# Altium schematic sheet Amplifier_2.SchDoc
size A4
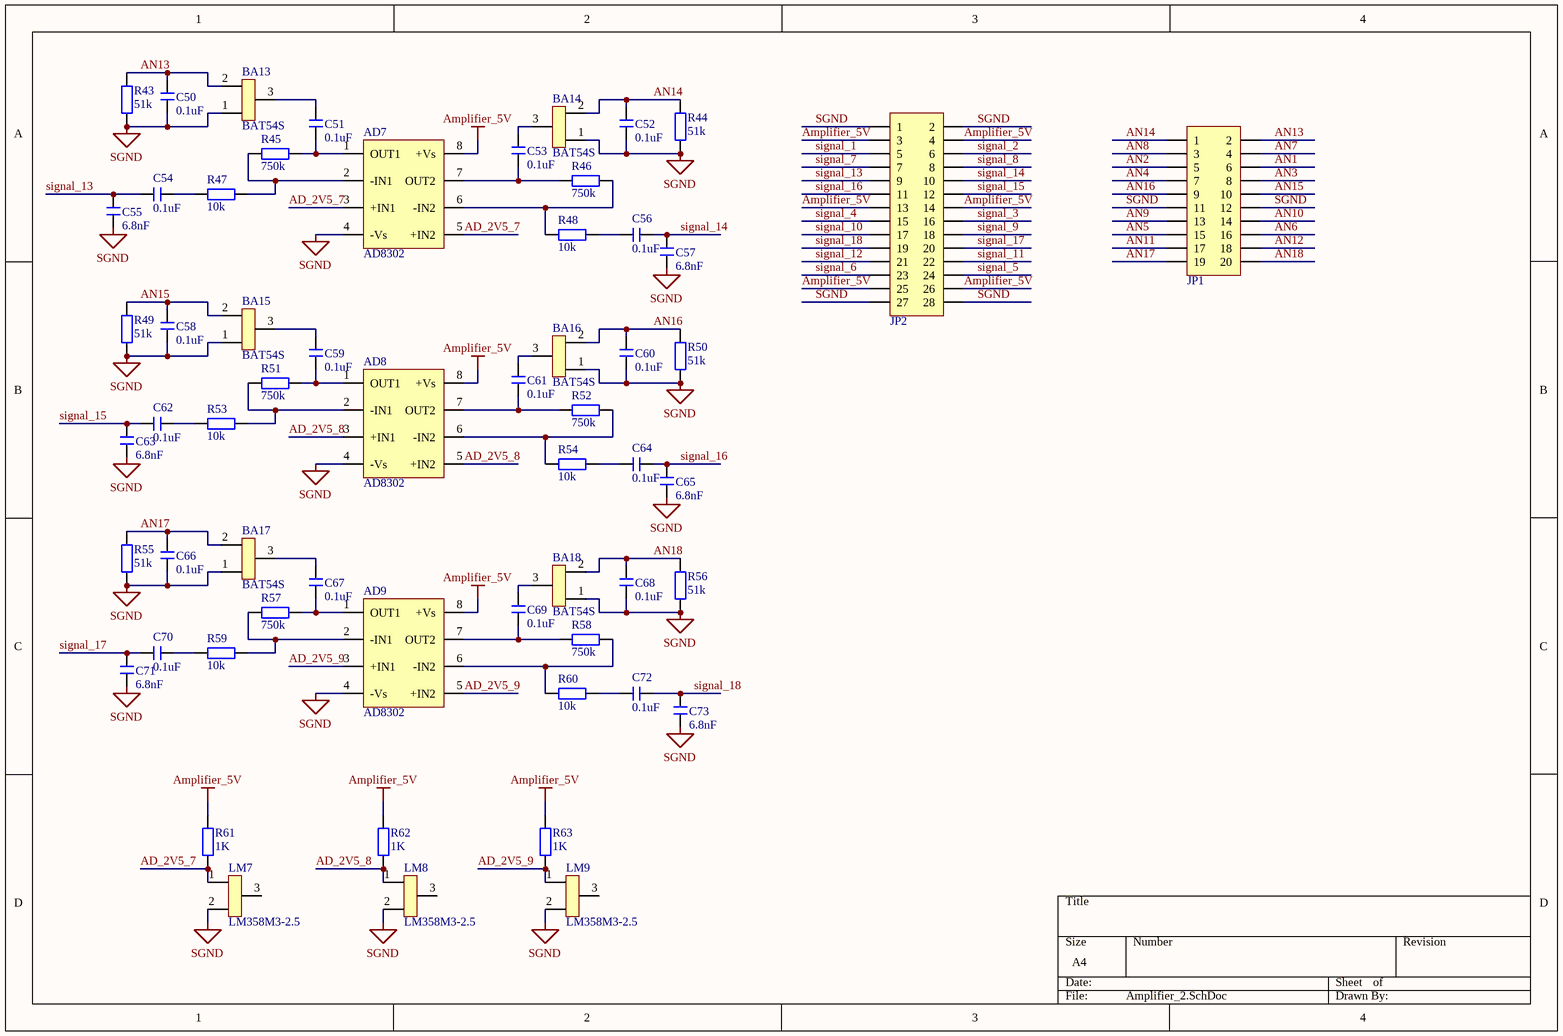
[diagram p0: Amplifier_2.SchDoc]

## Parts
AD7  AD8302  [SOIC-8]
AD8  AD8302  [SOIC-8]
AD9  AD8302  [SOIC-8]
BA13  BAT54S  [SOT23]
BA14  BAT54S  [SOT23]
BA15  BAT54S  [SOT23]
BA16  BAT54S  [SOT23]
BA17  BAT54S  [SOT23]
BA18  BAT54S  [SOT23]
C50  0.1uF  [C 0603_L]
C51  0.1uF  [C 0603_L]
C52  0.1uF  [C 0603_L]
C53  0.1uF  [C 0603_L]
C54  0.1uF  [C 0603_L]
C55  6.8nF  [C 0805_L]
C56  0.1uF  [C 0603_L]
C57  6.8nF  [C 0805_L]
C58  0.1uF  [C 0603_L]
C59  0.1uF  [C 0603_L]
C60  0.1uF  [C 0603_L]
C61  0.1uF  [C 0603_L]
C62  0.1uF  [C 0603_L]
C63  6.8nF  [C 0805_L]
C64  0.1uF  [C 0603_L]
C65  6.8nF  [C 0805_L]
C66  0.1uF  [C 0603_L]
C67  0.1uF  [C 0603_L]
C68  0.1uF  [C 0603_L]
C69  0.1uF  [C 0603_L]
C70  0.1uF  [C 0603_L]
C71  6.8nF  [C 0805_L]
C72  0.1uF  [C 0603_L]
C73  6.8nF  [C 0805_L]
JP1  Header 2X10  [HDR2.54-LI-2x10P]  (value not drawn)
JP2  Header 2X11  [HDR2.54-LI-2x14P]  (value not drawn)
LM7  LM358M3-2.5  [SOT23]
LM8  LM358M3-2.5  [SOT23]
LM9  LM358M3-2.5  [SOT23]
R43  51k  [R 0603_L]
R44  51k  [R 0603_L]
R45  750k  [R 0603_L]
R46  750k  [R 0603_L]
R47  10k  [R 0603_L]
R48  10k  [R 0603_L]
R49  51k  [R 0603_L]
R50  51k  [R 0603_L]
R51  750k  [R 0603_L]
R52  750k  [R 0603_L]
R53  10k  [R 0603_L]
R54  10k  [R 0603_L]
R55  51k  [R 0603_L]
R56  51k  [R 0603_L]
R57  750k  [R 0603_L]
R58  750k  [R 0603_L]
R59  10k  [R 0603_L]
R60  10k  [R 0603_L]
R61  1K  [R 0603_L]
R62  1K  [R 0603_L]
R63  1K  [R 0603_L]

## Nets
Amplifier_5V: AD7.8(+Vs) AD8.8(+Vs) AD9.8(+Vs) JP2.3 JP2.4 JP2.13 JP2.14 JP2.25 JP2.26 R61.1 R62.1 R63.1
SGND: AD7.4(-Vs) AD8.4(-Vs) AD9.4(-Vs) BA13.1 BA14.1 BA15.1 BA16.1 BA17.1 BA18.1 C50.1 C52.1 C55.1 C57.1 C58.1 C60.1 C63.1 C65.1 C66.1 C68.1 C71.1 C73.1 JP1.11 JP1.12 JP2.1 JP2.2 JP2.27 JP2.28 LM7.2 LM8.2 LM9.2 R43.1 R44.1 R49.1 R50.1 R55.1 R56.1
AD_2V5_7: AD7.3(+IN1) AD7.5(+IN2) LM7.1 R61.2
AD_2V5_8: AD8.3(+IN1) AD8.5(+IN2) LM8.1 R62.2
AD_2V5_9: AD9.3(+IN1) AD9.5(+IN2) LM9.1 R63.2
AN1: JP1.6
AN2: JP1.5
AN3: JP1.8
AN4: JP1.7
AN5: JP1.15
AN6: JP1.16
AN7: JP1.4
AN8: JP1.3
AN9: JP1.13
AN10: JP1.14
AN11: JP1.17
AN12: JP1.18
AN13: BA13.2 C50.2 JP1.2 R43.2
AN14: BA14.2 C52.2 JP1.1 R44.2
AN15: BA15.2 C58.2 JP1.10 R49.2
AN16: BA16.2 C60.2 JP1.9 R50.2
AN17: BA17.2 C66.2 JP1.19 R55.2
AN18: BA18.2 C68.2 JP1.20 R56.2
signal_1: JP2.5
signal_2: JP2.6
signal_3: JP2.16
signal_4: JP2.15
signal_5: JP2.24
signal_6: JP2.23
signal_7: JP2.7
signal_8: JP2.8
signal_9: JP2.18
signal_10: JP2.17
signal_11: JP2.22
signal_12: JP2.21
signal_13: C54.1 C55.2 JP2.9
signal_14: C56.2 C57.2 JP2.10
signal_15: C62.1 C63.2 JP2.12
signal_16: C64.2 C65.2 JP2.11
signal_17: C70.1 C71.2 JP2.20
signal_18: C72.2 C73.2 JP2.19
NetAD7_1: AD7.1(OUT1) C51.1 R45.2
NetAD7_2: AD7.2(-IN1) R45.1 R47.2
NetAD7_6: AD7.6(-IN2) R46.2 R48.1
NetAD7_7: AD7.7(OUT2) C53.1 R46.1
NetAD8_1: AD8.1(OUT1) C59.1 R51.2
NetAD8_2: AD8.2(-IN1) R51.1 R53.2
NetAD8_6: AD8.6(-IN2) R52.2 R54.1
NetAD8_7: AD8.7(OUT2) C61.1 R52.1
NetAD9_1: AD9.1(OUT1) C67.1 R57.2
NetAD9_2: AD9.2(-IN1) R57.1 R59.2
NetAD9_6: AD9.6(-IN2) R58.2 R60.1
NetAD9_7: AD9.7(OUT2) C69.1 R58.1
NetBA13_3: BA13.3 C51.2
NetBA14_3: BA14.3 C53.2
NetBA15_3: BA15.3 C59.2
NetBA16_3: BA16.3 C61.2
NetBA17_3: BA17.3 C67.2
NetBA18_3: BA18.3 C69.2
NetC54_2: C54.2 R47.1
NetC56_1: C56.1 R48.2
NetC62_2: C62.2 R53.1
NetC64_1: C64.1 R54.2
NetC70_2: C70.2 R59.1
NetC72_1: C72.1 R60.2

Not connected (* = marked no-connect by the designer): LM7 3; LM8 3; LM9 3

## Library data of the parts
C50-C73 = C: 贴片电容; BOM名称: 无极性贴片电容; 封装库来自淘宝卖家 ID：黄晶宝石: 其他店铺购入均为盗版假冒封装库; 联系卖家，免费查找封装: 唯一出售店铺网址https://shop463601444.taobao.com
JP1 = Header 10X2: 10*2P接插件; 封装库来自淘宝卖家  ID：黄晶宝石: 其他店铺购入均为盗版假冒封装库，请立即申请退款; 技术支持， 联系售后: 唯一出售店铺网址https://shop463601444.taobao.com; BOM名称: 10*2P接插件
JP2 = Header 14X2: 14*2P接插件; 封装库来自淘宝卖家  ID：黄晶宝石: 其他店铺购入均为盗版假冒封装库，请立即申请退款; 技术支持， 联系售后: 唯一出售店铺网址https://shop463601444.taobao.com; BOM名称: 14*2P接插件
R43-R63 = R: 贴片电阻; 封装库来自淘宝卖家 ID：黄晶宝石: 其他店铺购入均为盗版假冒封装库; 联系卖家，免费查找封装: 唯一出售店铺网址https://shop463601444.taobao.com; BOM名称: 贴片电阻